# EAGLE schematic board (EAGLE 5.06)
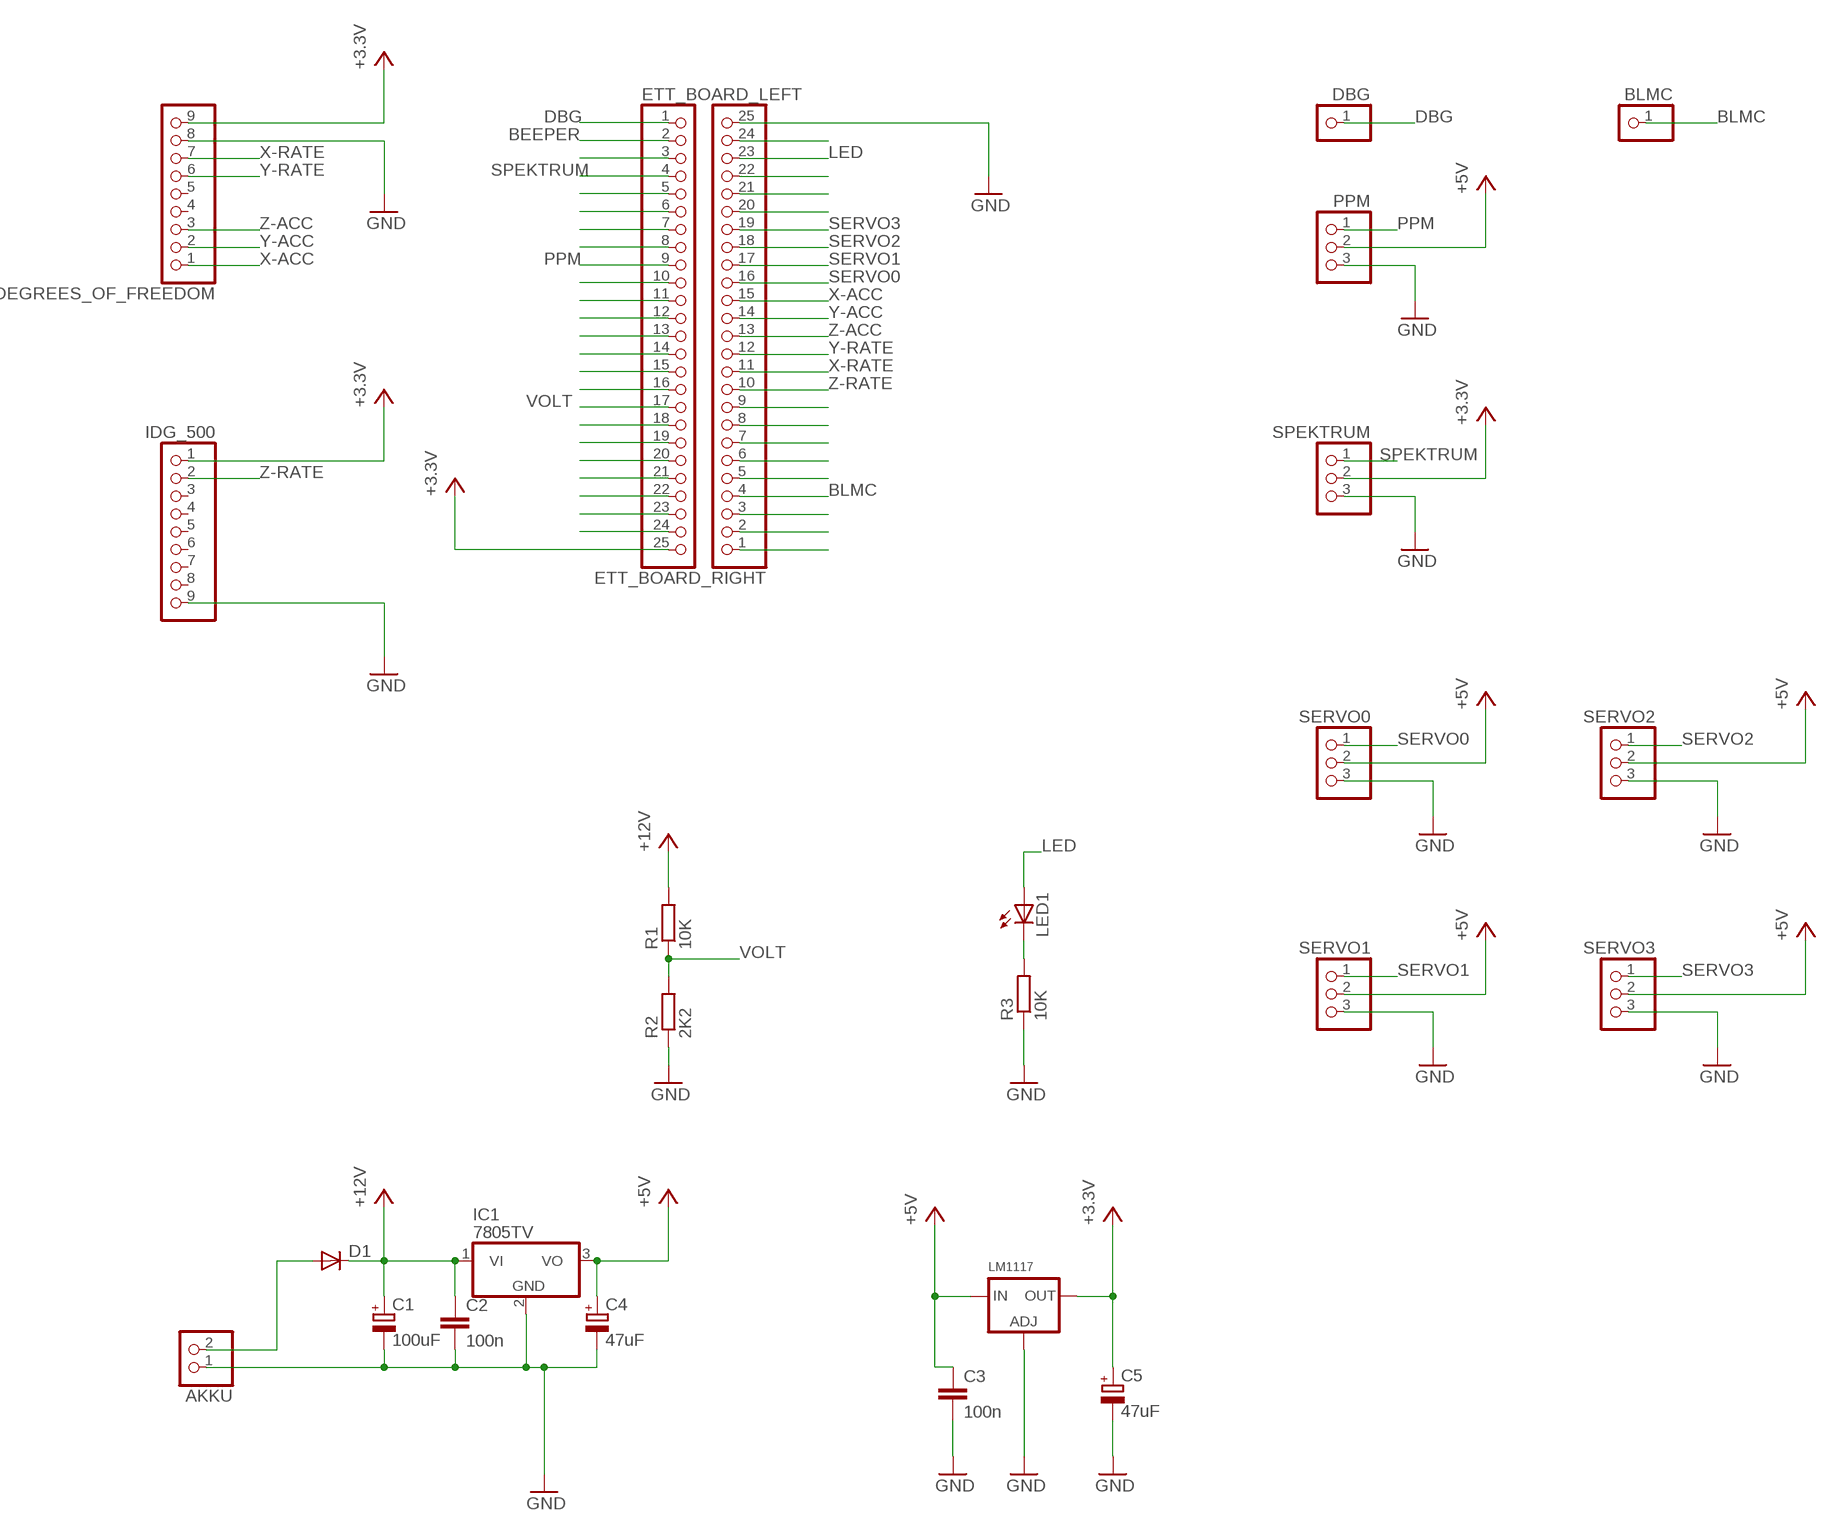
[diagram p0: schematic, sheet 1]

## Parts
5_DEGREES_OF_FREEDOM  PINHD-1X9  [1X09]
AKKU  PINHD-1X2  [1X02]
BLMC  PINHD-1X1  [1X01]
C1  100uF  CPOL-EUE2.5-7  [E2,5-7]
C2  100n  C-EU025-050X050  [C025-050X050]
C3  100n  C-EU025-050X050  [C025-050X050]
C4  47uF  CPOL-EUE2.5-7  [E2,5-7]
C5  47uF  CPOL-EUE2.5-7  [E2,5-7]
D1  DIODE-D-10  [D-10]
DBG  PINHD-1X1  [1X01]
ETT_BOARD_LEFT  PINHD-1X25  [1X25]
ETT_BOARD_RIGHT  PINHD-1X25  [1X25]
IC1  7805TV  [TO220V]
IDG_500  PINHD-1X9  [1X09]
LED1  LED5MM  [LED5MM]
LM1117  LM1117SOT223-WAVE  [SOT223-W]
PPM  PINHD-1X3  [1X03]
R1  10K  R-EU_0309/10  [0309/10]
R2  2K2  R-EU_0309/10  [0309/10]
R3  10K  R-EU_0309/10  [0309/10]
SERVO0  PINHD-1X3  [1X03]
SERVO1  PINHD-1X3  [1X03]
SERVO2  PINHD-1X3  [1X03]
SERVO3  PINHD-1X3  [1X03]
SPEKTRUM  PINHD-1X3  [1X03]

## Nets
+3.3V: 5_DEGREES_OF_FREEDOM.9 C5.+ ETT_BOARD_LEFT.25 IDG_500.1 LM1117.2(OUT) SPEKTRUM.2
+5V: C3.1 C4.+ IC1.3(VO) LM1117.3(IN) PPM.2 SERVO0.2 SERVO1.2 SERVO2.2 SERVO3.2
+12V: C1.+ C2.1 D1.C IC1.1(VI) R1.2
BEEPER: ETT_BOARD_LEFT.2
BLMC: BLMC.1 ETT_BOARD_RIGHT.4
DBG: DBG.1 ETT_BOARD_LEFT.1
GND: 5_DEGREES_OF_FREEDOM.8 AKKU.1 C1.- C2.2 C3.2 C4.- C5.- ETT_BOARD_RIGHT.25 IC1.2(GND) IDG_500.9 LM1117.1(ADJ) PPM.3 R2.1 R3.1 SERVO0.3 SERVO1.3 SERVO2.3 SERVO3.3 SPEKTRUM.3
LED: ETT_BOARD_RIGHT.23 LED1.A
N$1: LED1.K(C) R3.2
N$2: AKKU.2 D1.A
N$3: ETT_BOARD_LEFT.3
N$5: ETT_BOARD_LEFT.5
N$6: ETT_BOARD_LEFT.6
N$7: ETT_BOARD_LEFT.7
N$8: ETT_BOARD_LEFT.8
N$10: ETT_BOARD_LEFT.10
N$11: ETT_BOARD_LEFT.11
N$12: ETT_BOARD_LEFT.12
N$13: ETT_BOARD_LEFT.13
N$14: ETT_BOARD_LEFT.14
N$15: ETT_BOARD_LEFT.15
N$16: ETT_BOARD_LEFT.16
N$18: ETT_BOARD_LEFT.18
N$19: ETT_BOARD_LEFT.19
N$20: ETT_BOARD_LEFT.20
N$21: ETT_BOARD_LEFT.21
N$22: ETT_BOARD_LEFT.22
N$23: ETT_BOARD_LEFT.23
N$24: ETT_BOARD_LEFT.24
N$27: ETT_BOARD_RIGHT.24
N$29: ETT_BOARD_RIGHT.22
N$30: ETT_BOARD_RIGHT.21
N$31: ETT_BOARD_RIGHT.20
N$42: ETT_BOARD_RIGHT.9
N$43: ETT_BOARD_RIGHT.8
N$44: ETT_BOARD_RIGHT.7
N$45: ETT_BOARD_RIGHT.6
N$46: ETT_BOARD_RIGHT.5
N$48: ETT_BOARD_RIGHT.3
N$49: ETT_BOARD_RIGHT.2
N$50: ETT_BOARD_RIGHT.1
PPM: ETT_BOARD_LEFT.9 PPM.1
SERVO0: ETT_BOARD_RIGHT.16 SERVO0.1
SERVO1: ETT_BOARD_RIGHT.17 SERVO1.1
SERVO2: ETT_BOARD_RIGHT.18 SERVO2.1
SERVO3: ETT_BOARD_RIGHT.19 SERVO3.1
SPEKTRUM: ETT_BOARD_LEFT.4 SPEKTRUM.1
VOLT: ETT_BOARD_LEFT.17 R1.1 R2.2
X-ACC: 5_DEGREES_OF_FREEDOM.1 ETT_BOARD_RIGHT.15
X-RATE: 5_DEGREES_OF_FREEDOM.7 ETT_BOARD_RIGHT.11
Y-ACC: 5_DEGREES_OF_FREEDOM.2 ETT_BOARD_RIGHT.14
Y-RATE: 5_DEGREES_OF_FREEDOM.6 ETT_BOARD_RIGHT.12
Z-ACC: 5_DEGREES_OF_FREEDOM.3 ETT_BOARD_RIGHT.13
Z-RATE: ETT_BOARD_RIGHT.10 IDG_500.2
Unconnected: 5_DEGREES_OF_FREEDOM.4 5_DEGREES_OF_FREEDOM.5 IDG_500.3 IDG_500.4 IDG_500.5 IDG_500.6 IDG_500.7 IDG_500.8

## Library data of the parts
5_DEGREES_OF_FREEDOM IDG_500 = pinhead:PINHD-1X9: PIN HEADER
AKKU = pinhead:PINHD-1X2: PIN HEADER
BLMC DBG = pinhead:PINHD-1X1: PIN HEADER
C1 C4 C5 = rcl:CPOL-EU: POLARIZED CAPACITOR, European symbol
C2 C3 = rcl:C-EU: CAPACITOR, European symbol
D1 = diode:DIODE-: DIODE
ETT_BOARD_LEFT ETT_BOARD_RIGHT = pinhead:PINHD-1X25: PIN HEADER
IC1 = linear:78*: Positive VOLTAGE REGULATOR Source: http://cache.national.com/ds/LM/LM78L05.pdf http://www.fairchildsemi.com/ds/LM/LM7805.pdf
LED1 = led:LED: LED OSRAM: - CHIPLED LG R971, LG N971, LY N971, LG Q971, LY Q971, LO R971, LY R971 LH N974, LH R974 LS Q976, LO Q976, LY Q976 LO Q996 - Hyper CHIPLED LW Q18S LB Q993, LB Q99A, LB R99A - SideLED LS A670, LO A670, LY A670, LG A670, LP A670 LB A673, LV A673, LT A673, LW A673 LH A674 LY A675 LS A676, LA A676, LO A676, LY A676, LW A676 LS A679, LY A679, LG A679 - Hyper Micro SIDELED® LS Y876, LA Y876, LO Y876, LY Y876 LT Y87S - SmartLED LW L88C, LW L88S LB L89C, LB L89S, LG L890 LS L89K, LO L89K, LY L89K LS L896, LA L896, LO L896, LY L896 - TOPLED LS T670, LO T670, LY T670, LG T670, LP T670 LSG T670, LSP T670, LSY T670, LOP T670, LYG T670 LG T671, LOG T671, LSG T671 LB T673, LV T673, LT T673, LW T673 LH T674 LS T676, LA T676, LO T676, LY T676, LB T676, LH T676, LSB T676, LW T676 LB T67C, LV T67C, LT T67C, LS T67K, LO T67K, LY T67K, LW E67C LS E67B, LA E67B, LO E67B, LY E67B, LB E67C, LV E67C, LT E67C LW T67C LS T679, LY T679, LG T679 LS T770, LO T770, LY T770, LG T770, LP T770 LB T773, LV T773, LT T773, LW T773 LH T774 LS E675, LA E675, LY E675, LS T675 LS T776, LA T776, LO T776, LY T776, LB T776 LHGB T686 LT T68C, LB T68C - Hyper Mini TOPLED® LB M676 - Mini TOPLED Santana® LG M470 LS M47K, LO M47K, LY M47K Source: http://www.osram.convergy.de LUXEON: - LUMILED® LXK2-PW12-R00, LXK2-PW12-S00, LXK2-PW14-U00, LXK2-PW14-V00 LXK2-PM12-R00, LXK2-PM12-S00, LXK2-PM14-U00 LXK2-PE12-Q00, LXK2-PE12-R00, LXK2-PE12-S00, LXK2-PE14-T00, LXK2-PE14-U00 LXK2-PB12-K00, LXK2-PB12-L00, LXK2-PB12-M00, LXK2-PB14-N00, LXK2-PB14-P00, LXK2-PB14-Q00 LXK2-PR12-L00, LXK2-PR12-M00, LXK2-PR14-Q00, LXK2-PR14-R00 LXK2-PD12-Q00, LXK2-PD12-R00, LXK2-PD12-S00 LXK2-PH12-R00, LXK2-PH12-S00 LXK2-PL12-P00, LXK2-PL12-Q00, LXK2-PL12-R00 Source: www.luxeon.com KINGBRIGHT: KA-3528ASYC Source: www.kingbright.com
LM1117 = microbuilder:LM1117: LM1117 Voltage Regulator LM1117 Adjustable Voltage regulator [Digikey: LM1117IMP-ADJDKR-ND] LM1117 3.3V Voltage regulator [AP1117E33GDIDKR-ND] LM1117 5.0V Voltage regulator [AP1117E50GDIDKR-ND] SOT223-REFLOW - SOT223 package for solder paste/reflow ovens SOT223-WAVE - SOT223 package for hand-soldering (larger pads) Note: For the fixed-voltage regulators, simply set the ADJ pin to GND.
PPM SERVO0 SERVO1-SERVO3 SPEKTRUM = pinhead:PINHD-1X3: PIN HEADER
R1-R3 = resistor:R-EU_: RESISTOR, European symbol